# EAGLE board ebox (EAGLE 6.3)
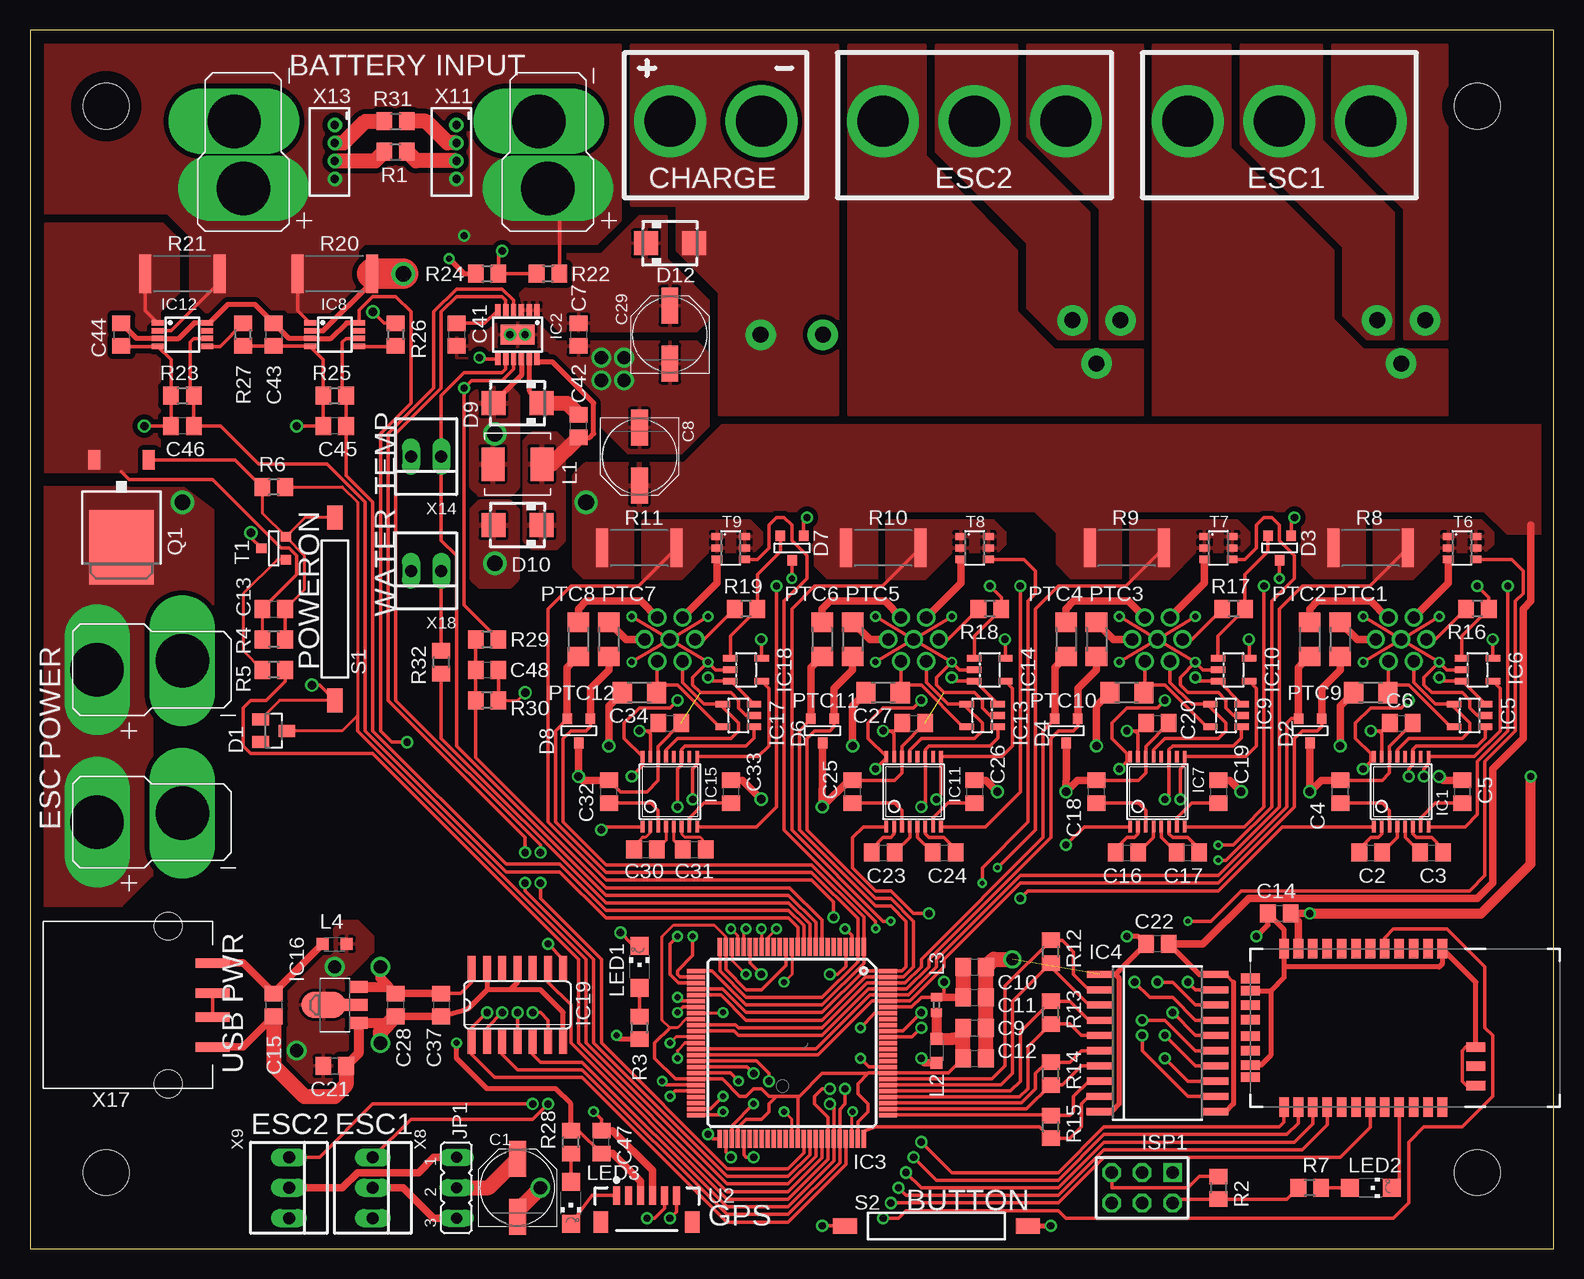
[diagram p2: board, top side]
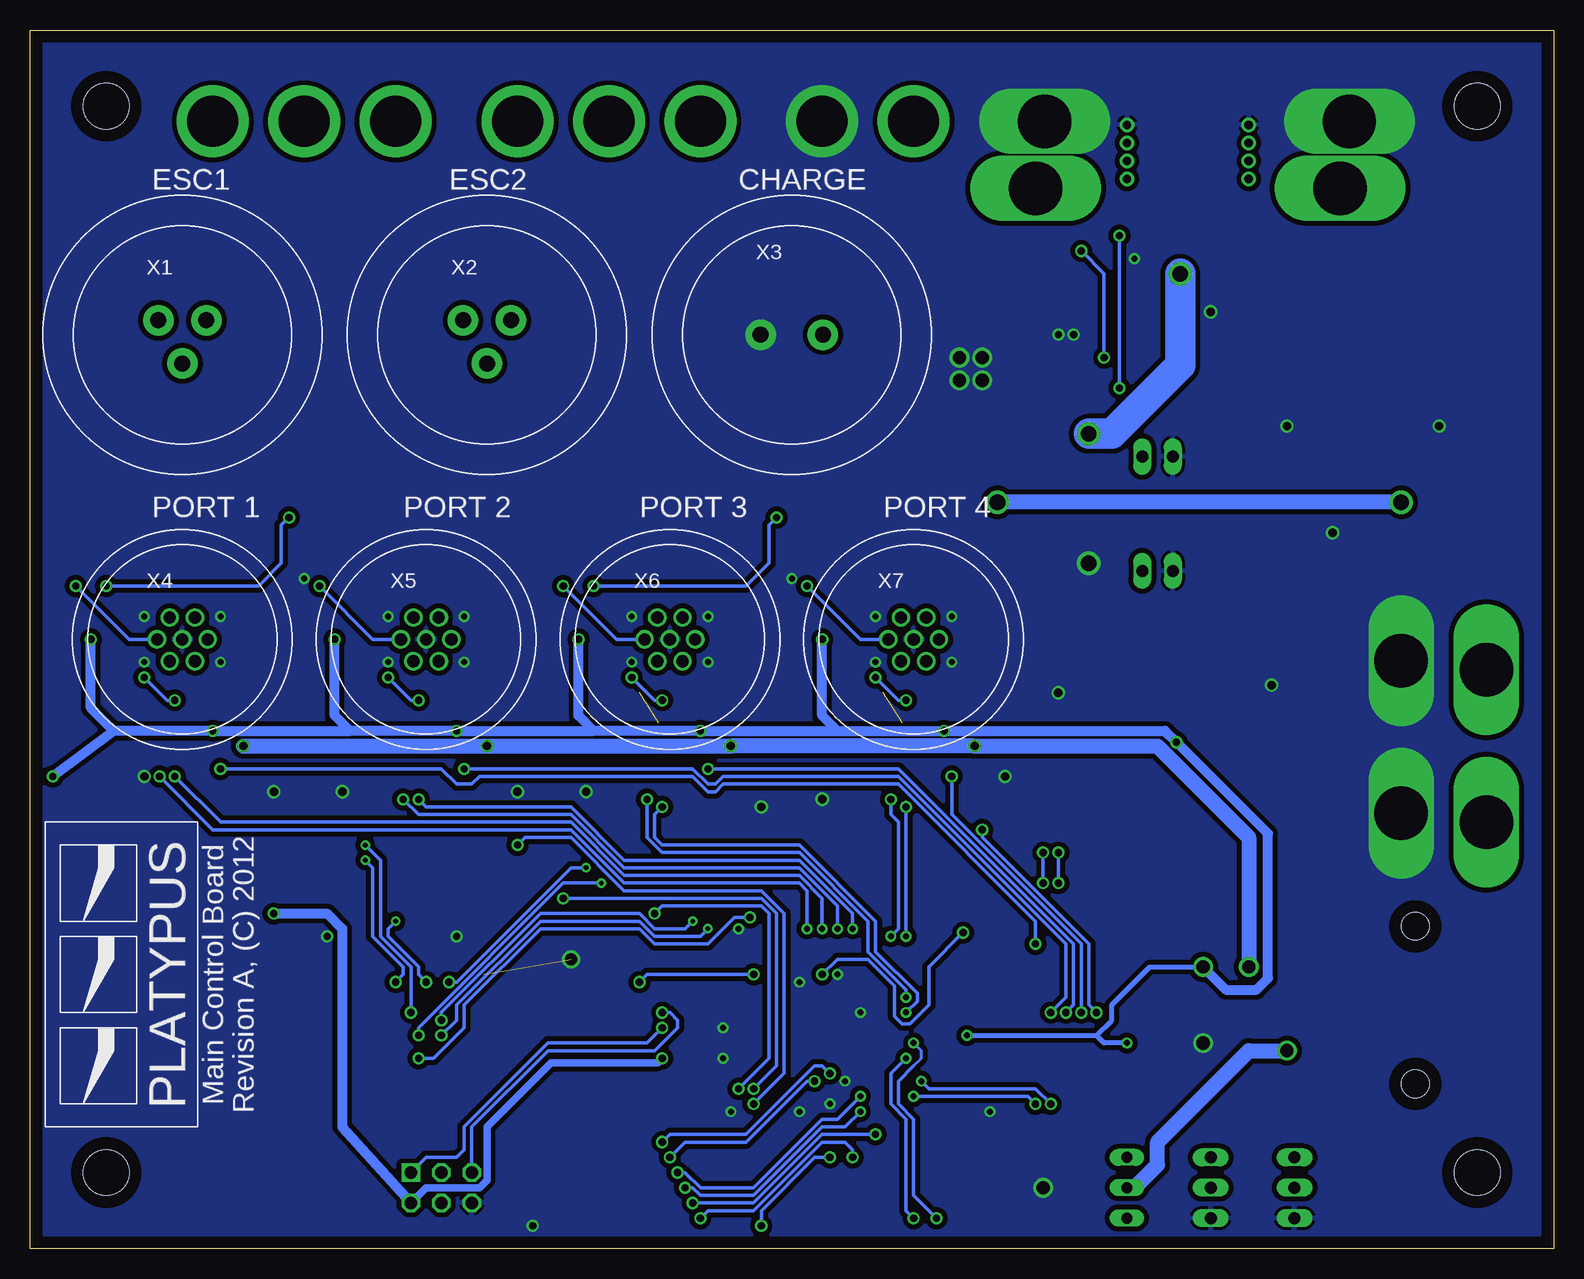
[diagram p3: board, bottom side, seen from below]

Size 127 x 101.6 mm. Coordinates in mm from the lower left corner, seen from the top.
Outline: 0,0 127,0 127,101.6 0,101.6 0,0
Copper layers (1*16): Top 0.035mm / dielectric 1.5mm / Bottom 0.035mm
Design rules "default *": minimum track width 10mil, minimum drill 15mil, track to track 5mil, track to pad 5mil, pad to pad 5mil, via to via 5mil, smd to smd 5mil, copper to edge 40mil, drill to drill 8mil, minimum pad ring 10mil, minimum via ring 8mil, stop-mask expansion 4mil, vias tented up to drill 0mil, thermal gap 10mil
Holes 3.81 mm at 120.65,95.25 120.65,6.35 6.35,6.35 6.35,95.25

## Footprints (pad centres in the part's own frame; a part is rotated, then mirrored left to right if it is on the bottom)
BULLET = drill 4.25 pad 6: P$1 0,0
PANASONIC_D = smd 3 x 1.4: + 2.4,0; - -2.4,0
C0805 = smd 1.3 x 1.5: 1 -0.95,0; 2 0.95,0
SOT23 = smd 1 x 1.4: 1 -0.95,-1.1; 2 0.95,-1.1; 3 0,1.1
SOT-23 = smd 0.787 x 0.889: 1 0.025,-1.016; 2 -0.94,1.016; 3 0.991,1.016
SMA = smd 2 x 2: A 2,0; C -2,0
TSSOP16 = smd 0.305 x 0.991: 1 -2.275,-2.918; 2 -1.625,-2.918; 3 -0.975,-2.918; 4 -0.325,-2.918; 5 0.325,-2.918; 6 0.975,-2.918; 7 1.625,-2.918; 8 2.275,-2.918; 9 2.275,2.918; 10 1.625,2.918; 11 0.975,2.918; 12 0.325,2.918; 13 -0.325,2.918; 14 -0.975,2.918; 15 -1.625,2.918; 16 -2.275,2.918
MSOP12-MSE = smd 0.45 x 1: 1 -1.625,-2.05; 2 -0.975,-2.05; 3 -0.325,-2.05; 4 0.325,-2.05; 5 0.975,-2.05; 6 1.625,-2.05; 7 1.625,2.05; 8 0.975,2.05; 9 0.325,2.05; 10 -0.325,2.05; 11 -0.975,2.05; 12 -1.625,2.05 | smd 2.845 x 1.651: 13 0,0
TQFP100 = smd 1.5 x 0.35: 1 -8,6; 2 -8,5.5; 3 -8,5; 4 -8,4.5; 5 -8,4; 6 -8,3.5; 7 -8,3; 8 -8,2.5; 9 -8,2; 10 -8,1.5; 11 -8,1; 12 -8,0.5; 13 -8,0; 14 -8,-0.5; 15 -8,-1; 16 -8,-1.5; 17 -8,-2; 18 -8,-2.5; 19 -8,-3; 20 -8,-3.5; 21 -8,-4; 22 -8,-4.5; 23 -8,-5; 24 -8,-5.5; 25 -8,-6; 51 8,-6; 52 8,-5.5; 53 8,-5; 54 8,-4.5; 55 8,-4; 56 8,-3.5; 57 8,-3; 58 8,-2.5; 59 8,-2; 60 8,-1.5; 61 8,-1; 62 8,-0.5; 63 8,0; 64 8,0.5; 65 8,1; 66 8,1.5; 67 8,2; 68 8,2.5; 69 8,3; 70 8,3.5; 71 8,4; 72 8,4.5; 73 8,5; 74 8,5.5; 75 8,6 | smd 0.35 x 1.5: 26 -6,-8; 27 -5.5,-8; 28 -5,-8; 29 -4.5,-8; 30 -4,-8; 31 -3.5,-8; 32 -3,-8; 33 -2.5,-8; 34 -2,-8; 35 -1.5,-8; 36 -1,-8; 37 -0.5,-8; 38 0,-8; 39 0.5,-8; 40 1,-8; 41 1.5,-8; 42 2,-8; 43 2.5,-8; 44 3,-8; 45 3.5,-8; 46 4,-8; 47 4.5,-8; 48 5,-8; 49 5.5,-8; 50 6,-8; 76 6,8; 77 5.5,8; 78 5,8; 79 4.5,8; 80 4,8; 81 3.5,8; 82 3,8; 83 2.5,8; 84 2,8; 85 1.5,8; 86 1,8; 87 0.5,8; 88 0,8; 89 -0.5,8; 90 -1,8; 91 -1.5,8; 92 -2,8; 93 -2.5,8; 94 -3,8; 95 -3.5,8; 96 -4,8; 97 -4.5,8; 98 -5,8; 99 -5.5,8; 100 -6,8
SOIC20R = smd 0.6 x 2.2: 1 -5.715,-4.775; 2 -4.445,-4.775; 3 -3.175,-4.775; 4 -1.905,-4.775; 5 -0.635,-4.775; 6 0.635,-4.775; 7 1.905,-4.775; 8 3.175,-4.775; 9 4.445,-4.8; 10 5.715,-4.8; 11 5.715,4.8; 12 4.445,4.8; 13 3.175,4.8; 14 1.905,4.8; 15 0.635,4.8; 16 -0.635,4.8; 17 -1.905,4.8; 18 -3.175,4.8; 19 -4.445,4.8; 20 -5.715,4.8
SOT23-DBV = smd 0.55 x 1.2: 1 -0.95,-1.3; 2 0,-1.3; 3 0.95,-1.3; 4 0.95,1.3; 5 -0.95,1.3
MSOP8 = smd 0.45 x 1: 1 -0.975,-2.05; 2 -0.325,-2.05; 3 0.325,-2.05; 4 0.975,-2.05; 5 0.975,2.05; 6 0.325,2.05; 7 -0.325,2.05; 8 -0.975,2.05
SOT89 = smd 1 x 1.5: 1 -1.499,-1.981; 3 1.499,-1.981 | smd 1 x 2: 2 0,-1.727 | smd 2.2 x 3.7: 2@1 0,0.94
SO14 = smd 0.66 x 2.032: 1 -3.81,-3.073; 2 -2.54,-3.073; 3 -1.27,-3.073; 4 0,-3.073; 5 1.27,-3.073; 6 2.54,-3.073; 7 3.81,-3.073; 8 3.81,3.073; 9 2.54,3.073; 10 1.27,3.073; 11 0,3.073; 12 -1.27,3.073; 13 -2.54,3.073; 14 -3.81,3.073
AVR-ISP-6 = drill 1.016 square: 1 -2.54,-1.27 | drill 1.016 octagon: 2 -2.54,1.27; 3 0,-1.27; 4 0,1.27; 5 2.54,-1.27; 6 2.54,1.27
JP2 = drill 0.914 long: 1 -2.54,0; 2 0,0; 3 2.54,0
IHLP-2020CZ-11 = smd 1.918 x 2.794: 1 -2.038,0; 2 2.038,0
L2012C = smd 1 x 1: 1 -1,0; 2 1,0
0402 = smd 0.7 x 0.9: 1 -0.65,0; 2 0.65,0
CHIPLED_1206 = smd 1.5 x 1.5: A 0,-1.75; C 0,1.75
R1206 = smd 1.6 x 1.803: 1 -1.422,0; 2 1.422,0
TO252 = smd 1 x 1.6: 1 -2.28,-4.8; 2 2.28,-4.8 | smd 5.4 x 6.2: 3 0,2.5
R0805 = smd 1.3 x 1.5: 1 -0.95,0; 2 0.95,0
R6332 = smd 1 x 3.2: 1 -3.1,0; 2 3.1,0
CT10-G1 = smd 2 x 1.3: 1 -7.62,0; 2 7.62,0
SOT23-6 = smd 0.6 x 0.9: 1 -0.95,-1.15; 2 0,-1.15; 3 0.95,-1.15; 4 0.95,1.15; 5 0,1.15; 6 -0.95,1.15
RN41 = smd 0.8 x 1.6: 1 -6.6,-6.6; 2 -5.4,-6.6; 3 -4.2,-6.6; 4 -3,-6.6; 5 -1.8,-6.6; 6 -0.6,-6.6; 7 0.6,-6.6; 8 1.8,-6.6; 9 3,-6.6; 10 4.2,-6.6; 11 5.4,-6.6; 12 6.6,-6.6; 13 6.6,6.6; 14 5.4,6.6; 15 4.2,6.6; 16 3,6.6; 17 1.8,6.6; 18 0.6,6.6; 19 -0.6,6.6; 20 -1.8,6.6; 21 -3,6.6; 22 -4.2,6.6; 23 -5.4,6.6; 24 -6.6,6.6 | smd 1.6 x 0.8: 25 -9.4,4.8; 26 -9.4,3.2; 27 -9.4,1.6; 28 9.4,3.1; 29 9.4,-3.1; 30 9.4,-4.122; 31 9.4,-1.9; 32 9.4,-0.7; 33 9.4,0.7; 34 9.4,1.9; 35 9.4,4.122
EM406 = smd 0.6 x 1.55: 1 0,0; 2 1,0; 3 2,0; 4 3,0; 5 4,0; 6 5,0 | smd 1.2 x 1.8: P$1 -1.3,-2.225; P$2 6.3,-2.225
7381-3PG-300 = drill 1.321 pad 2.54: 1 2,1.2; 2 -2,1.2; 3 0,-2.4
7381-2PG-300 = drill 1.321 pad 2.54: 1 2.6,0; 2 -2.6,0
17984-7PG-300 = drill 1.016: 1 -1.054,1.826; 2 -2.108,0; 3 -1.054,-1.826; 4 1.054,-1.826; 5 2.108,0; 6 1.054,1.826; 7 0,0
22-23-2031 = drill 1 long: 1 -2.54,0; 2 0,0; 3 2.54,0
DEANS_MALE = drill 4.445 pad 4.826 long: NEG -0.762,2.54; POS 0,-3.048
B4B-ZR = drill 0.7 pad 1.1: 1 -2.25,0; 2 -0.75,0; 3 0.75,0; 4 2.25,0
22-23-2021 = drill 1 long: 1 -1.27,0; 2 1.27,0
DEANS_FEMALE = drill 4.445 pad 4.826 long: NEG -0.762,2.54; POS 0,-4.572
1001-002-01100 = smd 0.8 x 2.82: 1 -3.5,0; 2 -1,0; 3 1,0; 4 3.5,0 | hole 2.3: -6.57,-3.71; 6.57,-3.71

## Placement (x,y rotation side)
B1  BULLET  [BULLET]  104.14,93.98 0 top
B2  BULLET  [BULLET]  111.76,93.98 0 top
B3  BULLET  [BULLET]  96.52,93.98 0 top
B4  BULLET  [BULLET]  78.74,93.98 0 top
B5  BULLET  [BULLET]  86.36,93.98 0 top
B6  BULLET  [BULLET]  71.12,93.98 0 top
B7  BULLET  [BULLET]  53.34,93.98 0 top
B8  BULLET  [BULLET]  60.96,93.98 0 top
C1  68uF  [PANASONIC_D]  40.64,5.08 90 top
C2  0.1uF  [C0805]  111.76,33.02 0 top
C3  0.1uF  [C0805]  116.84,33.02 0 top
C4  0.1uF  [C0805]  109.22,38.1 90 top
C5  0.1uF  [C0805]  119.38,38.1 270 top
C6  0.1uF  [C0805]  114.3,43.81 0 top
C7  1uF  [C0805]  45.72,76.2 270 top
C8  68uF  [PANASONIC_D]  50.8,66.04 270 top
C9  10uF  [C0805]  78.74,18.41 0 top
C10  10uF  [C0805]  78.74,23.5 0 top
C11  0.1uF  [C0805]  78.74,20.95 0 top
C12  0.1uF  [C0805]  78.74,15.88 0 top
C13  0.1uF  [C0805]  20.32,53.34 0 top
C14  0.1uF  [C0805]  104.14,27.94 180 top
C15  10uF  [C0805]  20.32,20.32 270 top
C16  0.1uF  [C0805]  91.44,33.02 0 top
C17  0.1uF  [C0805]  96.52,33.02 0 top
C18  0.1uF  [C0805]  88.9,38.1 90 top
C19  0.1uF  [C0805]  99.06,38.1 270 top
C20  0.1uF  [C0805]  93.98,43.81 0 top
C21  1uF  [C0805]  25.4,15.24 0 top
C22  10uF  [C0805]  93.98,25.4 180 top
C23  0.1uF  [C0805]  71.12,33.02 0 top
C24  0.1uF  [C0805]  76.2,33.02 0 top
C25  0.1uF  [C0805]  68.58,38.1 90 top
C26  0.1uF  [C0805]  78.74,38.1 270 top
C27  0.1uF  [C0805]  73.66,43.81 0 top
C28  1uF  [C0805]  30.48,20.32 270 top
C29  68uF  [PANASONIC_D]  53.34,76.2 90 top
C30  0.1uF  [C0805]  51.31,33.27 0 top
C31  0.1uF  [C0805]  55.37,33.27 0 top
C32  0.1uF  [C0805]  48.26,38.1 90 top
C33  0.1uF  [C0805]  58.42,38.1 270 top
C34  0.1uF  [C0805]  53.34,43.81 0 top
C37  0.1uF  [C0805]  34.29,20.32 270 top
C41  10uF  [C0805]  35.56,76.2 270 top
C42  1uF  [C0805]  45.72,68.58 90 top
C43  0.1uF  [C0805]  20.32,76.2 270 top
C44  0.1uF  [C0805]  7.62,76.2 270 top
C45  10pF  [C0805]  25.4,68.58 180 top
C46  10pF  [C0805]  12.7,68.58 180 top
C47  10uF  [C0805]  47.62,8.89 90 top
C48  10pF  [C0805]  38.1,48.26 0 top
D1  [SOT23]  20.32,43.18 270 top
D2  GSOT05C  [SOT-23]  106.68,43.18 0 top
D3  [SOT-23]  104.14,58.42 0 top
D4  GSOT05C  [SOT-23]  86.36,43.18 0 top
D6  GSOT05C  [SOT-23]  66.04,43.18 0 top
D7  [SOT-23]  63.5,58.42 0 top
D8  GSOT05C  [SOT-23]  45.72,43.18 0 top
D9  MBRA340T3  [SMA]  40.64,70.48 180 top
D10  MBRA340T3  [SMA]  40.64,60.33 180 top
D12  MBRA340T3  [SMA]  53.34,83.82 0 top
IC1  MAX3221CUE  [TSSOP16]  114.3,38.1 0 top
IC2  LT3652  [MSOP12-MSE]  40.64,76.2 180 top
IC3  XMEGA128A1  [TQFP100]  63.5,17.14 270 top
IC4  LT1161  [SOIC20R]  93.98,17.14 270 top
IC5  SN74LVC1G125  [SOT23-DBV]  120.02,44.45 90 top
IC6  SN74LVC1G125  [SOT23-DBV]  120.65,48.26 270 top
IC7  MAX3221CUE  [TSSOP16]  93.98,38.1 0 top
IC8  INA170  [MSOP8]  25.4,76.2 270 top
IC9  SN74LVC1G125  [SOT23-DBV]  99.69,44.45 90 top
IC10  SN74LVC1G125  [SOT23-DBV]  100.33,48.26 270 top
IC11  MAX3221CUE  [TSSOP16]  73.66,38.1 0 top
IC12  INA170  [MSOP8]  12.7,76.2 270 top
IC13  SN74LVC1G125  [SOT23-DBV]  79.38,44.45 90 top
IC14  SN74LVC1G125  [SOT23-DBV]  80.01,48.26 270 top
IC15  MAX3221CUE  [TSSOP16]  53.34,38.1 0 top
IC16  MCP170333MB  [SOT89]  25.4,20.32 90 top
IC17  SN74LVC1G125  [SOT23-DBV]  59.05,44.45 90 top
IC18  SN74LVC1G125  [SOT23-DBV]  59.69,48.26 270 top
IC19  74ALS04D  [SO14]  40.64,20.32 0 top
ISP1  AVR-PDIVERT  [AVR-ISP-6]  92.71,5.08 180 top
JP1  [JP2]  35.56,5.08 270 top
L1  5.6uH  [IHLP-2020CZ-11]  40.64,65.41 180 top
L2  10uH  [L2012C]  75.56,16.51 270 top
L3  FERRITE  [0402]  75.56,20.32 270 top
L4  10uH  [L2012C]  25.4,25.4 0 top
LED1  YEL  [CHIPLED_1206]  50.8,23.5 0 top
LED2  RED  [CHIPLED_1206]  111.76,5.08 270 top
LED3  GRN  [CHIPLED_1206]  45.09,3.81 180 top
PTC1  50mA  [R1206]  109.22,50.8 90 top
PTC2  50mA  [R1206]  106.68,50.8 90 top
PTC3  50mA  [R1206]  88.9,50.8 90 top
PTC4  50mA  [R1206]  86.36,50.8 90 top
PTC5  50mA  [R1206]  68.58,50.8 90 top
PTC6  50mA  [R1206]  66.04,50.8 90 top
PTC7  50mA  [R1206]  48.26,50.8 90 top
PTC8  50mA  [R1206]  45.72,50.8 90 top
PTC9  1A  [R1206]  111.76,46.35 0 top
PTC10  1A  [R1206]  91.44,46.35 0 top
PTC11  1A  [R1206]  71.12,46.35 0 top
PTC12  1A  [R1206]  50.8,46.35 0 top
Q1  FDD4141TO252  [TO252]  7.62,60.96 180 top
R1  1k  [R0805]  30.48,91.44 0 top
R2  10k  [R0805]  99.06,5.08 270 top
R3  330  [R0805]  50.8,18.41 270 top
R4  1k  [R0805]  20.32,50.8 180 top
R5  10k  [R0805]  20.32,48.26 180 top
R6  100k  [R0805]  20.32,63.5 180 top
R7  330  [R0805]  106.68,5.08 180 top
R8  0.010  [R6332]  111.76,58.42 180 top
R9  0.010  [R6332]  91.44,58.42 180 top
R10  0.010  [R6332]  71.12,58.42 180 top
R11  0.010  [R6332]  50.8,58.42 180 top
R12  2K  [R0805]  85.09,24.77 90 top
R13  2K  [R0805]  85.09,19.68 90 top
R14  2K  [R0805]  85.09,14.61 90 top
R15  2K  [R0805]  85.09,10.16 90 top
R16  100k  [R0805]  120.65,53.34 180 top
R17  100k  [R0805]  100.33,53.34 180 top
R18  100k  [R0805]  80.01,53.34 180 top
R19  100k  [R0805]  59.69,53.34 180 top
R20  0.050  [R6332]  25.4,81.28 180 top
R21  0.010  [R6332]  12.7,81.28 180 top
R22  626k  [R0805]  43.18,81.28 0 top
R23  4.99k  [R0805]  12.7,71.12 0 top
R24  412k  [R0805]  38.1,81.28 0 top
R25  1k  [R0805]  25.4,71.12 0 top
R26  2k  [R0805]  30.48,76.2 270 top
R27  10k  [R0805]  17.78,76.2 90 top
R28  330  [R0805]  45.09,8.89 90 top
R29  10k  [R0805]  38.1,50.8 0 top
R30  2k  [R0805]  38.1,45.72 180 top
R31  1k  [R0805]  30.48,93.98 0 top
R32  1K  [R0805]  34.29,48.9 90 top
S1  REED-SWITCH-CT10-1530-G1  [CT10-G1]  25.4,53.34 270 top
S2  REED-SWITCH-CT10-1530-G1  [CT10-G1]  75.56,1.91 0 top
T1  [SOT-23]  20.32,58.42 270 top
T6  [SOT23-6]  119.38,58.42 270 top
T7  [SOT23-6]  99.06,58.42 270 top
T8  [SOT23-6]  78.74,58.42 270 top
T9  [SOT23-6]  58.42,58.42 270 top
U1  BLUETOOTH-RN42  [RN41]  111.12,18.41 180 top
U2  D2523T_  [EM406]  48.9,4.45 0 top
U$1  PLATYPUS_LOGO  [PLATYPUS_LOGO_SMALL]  119.38,22.86 90 bottom
X1  7381-3PG-300  [7381-3PG-300]  114.3,76.2 0 bottom
X2  7381-3PG-300  [7381-3PG-300]  88.9,76.2 0 bottom
X3  7381-2PG-300  [7381-2PG-300]  63.5,76.2 0 bottom
X4  17984-7PG-300  [17984-7PG-300]  114.3,50.8 0 bottom
X5  17984-7PG-300  [17984-7PG-300]  93.98,50.8 0 bottom
X6  17984-7PG-300  [17984-7PG-300]  73.66,50.8 0 bottom
X7  17984-7PG-300  [17984-7PG-300]  53.34,50.8 0 bottom
X8  22-23-2031  [22-23-2031]  28.57,5.08 270 top
X9  22-23-2031  [22-23-2031]  21.59,5.08 270 top
X10  DEANS-MALE  [DEANS_MALE]  43.18,91.44 0 top
X11  B4B-ZR  [B4B-ZR]  35.56,91.44 270 top
X12  DEANS-MALE  [DEANS_MALE]  17.78,91.44 0 top
X13  B4B-ZR  [B4B-ZR]  25.4,91.44 270 top
X14  22-23-2021  [22-23-2021]  33.02,66.04 180 top
X15  DEANS-FEMALE  [DEANS_FEMALE]  10.16,48.26 270 top
X16  DEANS-FEMALE  [DEANS_FEMALE]  10.16,35.56 270 top
X17  USB_A  [1001-002-01100]  15.24,20.32 270 top
X18  22-23-2021  [22-23-2021]  33.02,56.52 180 top

## Tracks (layer width: path | path; a pad name or v marks a point on that pad's centre or on a via)
3ROU  (via drill 0.38, 0.6)
  Top 0.305: 120.97,57.47 T6.4 123.5,57.47 124.46,56.52 124.46,54.61 123.83,53.98 123.83,43.18 121.28,40.64 121.28,31.11 120.02,29.84 100.97,29.84 98.42,27.3 v96.52,27.3 | IC4.18 97.16,20.32 95.25,22.23 v93.98,22.23
  Bottom 0.305: v96.52,27.3 97.16,26.67 97.16,26.04 94.61,23.5 94.61,22.86 v93.98,22.23
!CHRG  (via drill 0.6)
  Top 0.305: IC2.4 40.31,79.06 39.37,80.01 35.56,80.01 33.66,78.11 33.66,71.75 29.84,67.94 29.84,45.72 41.27,34.29 v41.27,33.02 | IC3.66 65,7.85 63.18,6.03 58.1,6.03 46.99,17.14 46.99,24.13 41.27,29.84 v41.27,30.48
  Bottom 0.305: v41.27,30.48 v41.27,33.02
!CHRG_FAULT  (via drill 0.6)
  Top 0.305: IC2.5 39.66,79.08 39.37,79.38 35.56,79.38 34.29,78.11 34.29,71.75 30.48,67.94 30.48,45.72 42.55,33.66 v42.55,33.02 | IC3.65 64.5,7.99 63.18,6.67 58.1,6.67 47.62,17.14 47.62,24.13 42.55,29.21 v42.55,30.48
  Bottom 0.305: v42.55,30.48 v42.55,33.02
!EN232_1  (via drill 0.6)
  Top 0.305: IC19.9 43.18,22.23 45.09,20.32 45.09,17.14 58.1,4.13 63.18,4.13 66.5,7.45 IC3.69 66.5,10.97 65.41,12.06 65.41,12.7 66.04,13.34 v66.67,13.34 | IC1.1 104.4,35.18 99.06,29.84 83.19,29.84 v82.55,29.21
  Bottom 0.305: v66.67,13.34 64.77,15.24 64.77,27.94 66.04,29.21 v82.55,29.21
!EN232_2  (via drill 0.6)
  Top 0.305: IC19.5 41.91,16.19 42.55,15.56 46.04,15.56 58.1,3.49 63.18,3.49 67,7.31 IC3.70 67,11.74 v66.67,12.06 | IC7.1 87.89,35.18 v86.36,33.66
  Bottom 0.305: v86.36,33.66 85.72,34.29 81.92,34.29 77.47,29.84 66.04,29.84 64.14,27.94 64.14,14.61 v66.67,12.06
!EN232_3  (via drill 0.6)
  Top 0.305: IC19.3 39.37,16.19 40.64,14.92 46.04,14.92 58.1,2.86 63.18,2.86 67.5,7.17 IC3.71 67.5,11.62 67.94,12.06 v67.94,13.34 | IC11.1 69.47,35.18 68.58,34.29 68.58,31.75 70.48,29.84 71.75,29.84 73.66,27.94 v74.93,27.94
  Bottom 0.305: v67.94,13.34 65.41,15.88 65.41,27.94 66.04,28.57 74.3,28.57 v74.93,27.94
!EN232_4  (via drill 0.6)
  Top 0.305: IC3.72 68,7.04 63.18,2.22 58.1,2.22 46.04,14.29 38.73,14.29 36.83,16.19 IC19.1 36.83,18.41 v38.1,19.68 | IC15.1 47.88,35.18 v47.62,34.92
  Bottom 0.305: v38.1,19.68 38.73,20.32 38.73,25.4 47.62,34.29 v47.62,34.92
+3V3  (via drill 0.5, 0.6, 1.1)
  Top 0.305: R7.2 104.78,4.13 R2.2 95.57,4.13 ISP1.2 | IC19.14 36.83,22.23 35.88,21.27 C37.1 | IC6.5 121.92,49.24 v121.92,50.8 | IC10.5 101.63,50.77 v101.6,50.8 | C27.1 72.08,43.18 71.75,43.18 | 71.75,43.18 v71.12,43.18 | IC14.5 81.31,50.77 v81.28,50.8 | IC18.5 60.96,49.24 v60.96,50.8 | C34.1 51.76,43.18 51.44,43.18 | 51.44,43.18 v50.8,43.18 | R28.2 45.73,9.84 C47.1 | IC8.8 27.45,78.25 28.57,79.38 30.48,79.38 31.75,78.11 31.75,70.48 29.21,67.94 29.21,43.18 30.16,42.23 v31.43,42.23 | IC1.15 112.67,42.9 112.39,43.18 | v111.76,43.18 112.39,43.18 | C6.1 112.72,43.18 112.39,43.18 | C20.1 92.39,43.18 92.08,43.18 | 92.08,43.18 v91.44,43.18 | IC7.15 92.36,42.9 92.08,43.18 | IC11.15 72.03,42.9 71.75,43.18 | IC15.15 51.72,42.9 51.44,43.18
  Top 0.406: C44.1 8.89,75.88 IC12.3 12.38,75.88 13.68,77.17 IC12.8 14.95,77.17 16.51,78.74 18.73,78.74 C43.1 21.59,75.88 IC8.3 25.07,75.88 26.38,77.17 IC8.8 | R28.2 45.09,12.06 43.81,13.34 38.1,13.34 35.56,15.88 v35.56,17.14 | R3.2 49.21,17.46 v48.9,17.78
  Top 0.61: U1.11 105.72,27.3 C14.1 v106.68,27.94 | 29.93,21.82 C28.1 C37.1 | L2.2 74.56,15.51 v74.3,15.88 | U2.3 50.9,5.62 48.58,7.94 C47.1
  Top 0.813: IC16.3 29.93,21.82 29.21,22.54 v29.21,23.5 | v106.68,27.94 120.97,27.94 125.09,32.07 v125.09,39.37
  Bottom 0.406: 29.06,23.5 v29.21,23.5 33.66,23.5 36.83,20.32 36.83,19.05 38.1,17.78 | v48.9,17.78 38.1,17.78 | v35.56,17.14 37.47,17.14 38.1,17.78
  Bottom 0.61: ISP1.2 93.98,5.08 89.53,5.08 88.9,5.71 88.9,10.16 83.55,15.51 74.66,15.51 v74.3,15.88
  Bottom 0.813: v106.68,27.94 102.23,27.94 100.97,26.67 100.97,10.16 ISP1.2 | v29.21,23.5 27.3,21.59 24.77,21.59 23.81,22.54 23.81,34.61 v31.43,42.23 32.38,43.18 v50.8,43.18 59.69,43.18 | v121.92,50.8 121.92,45.09 120.02,43.18 | 80.01,43.18 v71.12,43.18 59.69,43.18 | 100.33,43.18 v91.44,43.18 80.01,43.18 | 120.02,43.18 v111.76,43.18 100.33,43.18 | 100.33,43.18 101.6,44.45 v101.6,50.8 | 80.01,43.18 81.28,44.45 v81.28,50.8 | 59.69,43.18 60.96,44.45 v60.96,50.8 | 120.02,43.18 v125.09,39.37
+5V  (via drill 0.7, 1.1)
  Top 0.61: PTC12.1 48.26,45.24 v48.26,41.91 | PTC11.1 68.58,45.24 v68.58,41.91 | PTC10.1 88.9,45.24 v88.9,41.91 | PTC9.1 109.22,45.24 v109.22,41.91
  Top 1.27: JP1.2 38.24,5.08 C1.+
  Bottom 1.27: JP1.2 34.92,5.08 33.02,6.99 33.02,8.89 25.4,16.51 v22.23,16.51 | v109.22,41.91 v88.9,41.91 v68.58,41.91 v48.26,41.91 33.02,41.91 25.4,34.29 v25.4,23.5
  pour Top (isolate 0.406): 25.4,26.67 25.4,25.4 20.32,20.95 20.32,15.88 23.5,12.7 24.77,12.7 26.04,13.97 26.04,15.88 26.67,16.51 26.67,22.86 28.57,24.77 28.57,26.04 27.3,27.3 26.04,27.3
+12V  (via drill 1.3)
  Top 0.305: IC4.20 99.69,22.86 100.33,22.23
  Top 0.406: C22.1 97.47,22.86 IC4.20 | 97.79,11.43 IC4.11 99.69,11.43 100.33,12.06 100.33,22.23
  Top 0.61: 125.09,60.33 125.09,53.98 124.46,53.34 124.46,42.55 121.92,40.01 121.92,30.48 120.65,29.21 101.6,29.21 97.79,25.4 C22.1
  Bottom 1.27: v12.7,62.23 v46.35,62.23
  pour Top (isolate 0.406, no thermals): 1.27,63.5 12.7,63.5 15.24,61.59 15.24,53.34 10.16,48.26 10.16,31.11 7.62,28.57 1.27,28.57
  pour Top (isolate 0.406): 46.35,65.41 54.61,65.41 57.78,68.58 127,68.58 127,59.69 123.19,59.69 121.28,61.59 111.12,61.59 111.12,55.88 107.31,55.88 106.05,57.15 106.05,60.33 104.78,61.59 90.81,61.59 90.81,55.88 87,55.88 85.72,57.15 85.72,59.69 83.82,61.59 70.48,61.59 70.48,55.88 66.67,55.88 65.41,57.15 65.41,60.33 64.14,61.59 50.16,61.59 50.16,55.88 46.35,55.88 45.4,56.83 45.4,64.45
  pour Top (isolate 0.406, no thermals): 46.35,60.33 46.35,55.88 49.53,55.88 49.53,60.96 46.35,60.96
  pour Top (isolate 0.406, no thermals): 66.67,60.96 66.67,56.52 67.31,55.88 69.22,55.88 69.22,60.96
  pour Top (isolate 0.406, no thermals): 86.36,60.96 86.36,57.15 87.63,55.88 89.53,55.88 89.53,60.96
  pour Top (isolate 0.406, no thermals): 107.31,61.59 107.31,56.52 107.95,55.88 109.86,55.88 109.86,61.59
AVR_AVCC  (via drill 0.6)
  Top 0.305: IC3.94 73.47,20.14 74.3,20.97 L3.1 | IC3.4 68,23.55 67.31,22.86 v66.67,22.86 | v76.2,22.23 76.2,20.95
  Top 0.61: C11.1 76.2,20.95 75.58,20.95 L3.1
  Top 1.27: C10.1 C11.1
  Bottom 0.305: v66.67,22.86 75.56,22.86 v76.2,22.23
AVR_VCC
  Top 0.254: IC3.34 54.7,19.14 53.98,18.41 53.34,18.41 52.7,19.05 52.7,26.04 53.66,26.99 57.02,26.99 58,26.01 IC3.24
  Top 0.305: C12.1 76.56,14.64 IC3.83 69.89,14.64 69.85,14.61 | 69.85,14.61 69,13.76 69,12.91 69.85,12.06 69.85,11.43 69,10.58 IC3.74 | 69.85,14.61 66.04,14.61 64.14,12.7 | IC3.64 64,12.56 64.14,12.7 | IC3.54 59,10.11 59.69,10.79 60.96,10.79 61.59,11.43 61.59,12.06 62.23,12.7 | 62.23,12.7 61.59,12.7 60.96,13.34 60.33,13.34 59.69,12.7 59.16,12.7 57.72,14.14 IC3.44 53.8,14.14 52.07,15.88 52.07,17.14 53.34,18.41 | 62.23,12.7 64.14,12.7 | IC3.24 58,23.28 59.69,21.59 60.96,21.59 63,23.63 IC3.14
  Top 0.813: L3.2 L2.1
  Top 1.016: L2.1 76.89,17.51 arc90 C9.1
  Top 1.27: C12.1 C9.1
BATT1
  Top 1.27: X11.2 34.81,92.19 33.02,93.98 R31.2
BATT2
  Top 1.27: X11.3 32.18,90.69 R1.2
BATT+  (via drill 0.6)
  Top 0.305: IC12.2 11.76,76.53 15.8,80.57 R21.1 | R20.2 22.3,78.22 IC8.1 | R22.2 44.13,87.44 X10.POS | R29.2 36.2,53.66 v36.2,71.75 36.83,72.39 39.37,72.39 40.31,73.33 IC2.9
  Bottom 0.305: v36.2,84.45 v36.2,71.75
  pour Top (isolate 0.406, no thermals): 1.27,100.33 1.27,86.36 11.43,86.36 13.34,84.45 13.34,79.38 14.61,78.11 25.4,78.11 27.3,80.01 27.3,83.19 27.94,83.82 47.31,83.82 49.21,85.72 49.21,100.33
BATT_CURR_IN
  Top 0.305: IC8.6 26.34,75.88 26.04,75.56 26.04,71.44 R25.2 C45.1 26.35,64.45 28.57,62.23 28.57,43.18 39.69,32.07 44.13,32.07 48.01,28.19 63.25,28.19 64.5,26.94 IC3.11
BATT_CURR_OUT
  Top 0.305: IC12.6 13.64,75.88 13.34,75.56 13.34,71.44 R23.2 C46.1 15.88,68.58 19.05,65.41 24.77,65.41 27.94,62.23 27.94,43.18 39.69,31.43 44.13,31.43 48.01,27.56 63.25,27.56 64,26.8 IC3.12
BATT_TEMP
  Top 0.305: IC2.8 39.66,73.32 39.37,73.03 36.2,73.03 34.29,71.12 X14.1 34.29,59.05 35.56,57.78 35.56,41.91 48.01,29.46 63.25,29.46 65.5,27.21 IC3.9
BATT_VSENSE
  Top 0.305: R29.1 C48.1 R30.2 37.15,40.95 48.01,30.1 63.31,30.1 66,27.41 IC3.8
BT_CTS  (via drill 0.5, 0.6)
  Top 0.305: U1.16 108.12,10.34 106.05,8.26 89.53,8.26 85.72,4.45 73.03,4.45 v72.39,5.08 | IC3.50 57.5,11.14 v57.78,11.43
  Bottom 0.305: v57.78,11.43 59.05,10.16 60.96,10.16 66.67,4.45 71.12,4.45 71.75,5.08 v72.39,5.08
BT_RESET  (via drill 0.6)
  Top 0.305: U1.5 112.92,25.93 113.67,26.67 118.11,26.67 121.28,23.5 121.28,18.41 121.92,17.78 121.92,12.7 119.38,10.16 116.2,10.16 114.94,8.89 114.94,3.81 113.67,2.54 86.36,2.54 85.72,3.17 73.03,3.17 72.39,2.54 v71.12,2.54 | IC3.52 58,8.04 v58.42,7.62
  Bottom 0.305: v58.42,7.62 58.42,8.26 59.05,8.89 60.96,8.89 66.67,3.17 70.48,3.17 v71.12,2.54
BT_RTS  (via drill 0.5, 0.6)
  Top 0.305: U1.15 106.92,10.4 105.41,8.89 89.53,8.89 85.72,5.08 74.3,5.08 v73.03,6.35 | IC3.49 56.73,11.64 v57.78,12.7
  Bottom 0.305: v73.03,6.35 72.39,6.35 71.12,5.08 66.67,5.08 60.96,10.79 59.69,10.79 v57.78,12.7
BT_RXD  (via drill 0.6)
  Top 0.305: U1.14 105.72,10.47 104.78,9.53 89.53,9.53 85.72,5.71 75.56,5.71 v73.66,7.62 | IC3.41 60.55,15.64 61.59,14.61 v61.59,13.97
  Bottom 0.305: v73.66,7.62 72.39,8.89 67.31,8.89 62.23,13.97 v61.59,13.97
BT_STATUS  (via drill 0.6)
  Top 0.305: v71.75,3.81 85.72,3.81 89.53,7.62 109.22,7.62 111.72,10.12 U1.19 | IC3.51 56.9,9.14 v56.52,9.53
  Bottom 0.305: v71.75,3.81 66.67,3.81 60.96,9.53 v56.52,9.53
BT_TXD  (via drill 0.6)
  Top 0.305: U1.13 104.53,10.54 104.14,10.16 89.53,10.16 85.72,6.35 76.83,6.35 v74.3,8.89 | IC3.42 59.78,15.14 v60.33,14.61
  Bottom 0.305: v60.33,14.61 60.96,15.24 61.59,15.24 67.31,9.53 73.66,9.53 v74.3,8.89
CHARGE
  pour Top (isolate 0.406, no thermals): 50.16,100.33 67.31,100.33 67.31,69.53 57.47,69.53 57.47,79.69 53.98,83.19 53.98,87 50.16,87
CHRG+  (via drill 1.3)
  Top 0.406: IC2.10 40.97,72.81 D9.A | IC8.2 24.45,76.53 28.5,80.57 R20.1
  Top 2.54: R20.1 v31.11,81.28
  Bottom 2.54: v31.11,81.28 31.11,73.66 36.83,67.94 v38.73,67.94
  pour Top: 36.83,71.12 37.47,71.75 40.01,71.75 40.64,71.12 40.64,63.5 40.01,62.87 37.47,62.87 36.83,63.5
EN232_1  (via drill 0.6)
  Top 0.305: IC6.3 119.35,47.37 | IC6.3 119.41,47.31 IC5.3 | IC1.16 111.76,41.27 | v114.94,45.72 114.3,45.09 111.76,45.09 110.49,43.81 110.49,42.55 111.76,41.27 | v117.47,47.62 117.8,47.31 IC6.3 | 111.76,41.27 111.76,40.64 v111.12,40.01 | IC19.8 44.45,24.13 v43.18,25.4
  Bottom 0.305: v114.94,45.72 115.57,45.72 v117.47,47.62 | v111.12,40.01 92.71,40.01 91.44,38.73 90.17,38.73 89.53,39.37 71.75,39.37 70.48,38.1 69.85,38.1 69.22,38.73 54.61,38.73 43.18,27.3 v43.18,25.4
EN232_2  (via drill 0.6)
  Top 0.305: IC9.3 99.08,47.31 IC10.3 97.47,47.31 v97.16,47.62 | IC7.16 91.44,41.27 | v94.61,45.72 93.98,45.09 91.44,45.09 90.17,43.81 90.17,42.55 91.44,41.27 | 91.44,41.27 91.44,40.64 v90.81,40.01 | IC19.6 43.18,19.05 42.55,19.68 v41.91,19.68
  Bottom 0.305: v97.16,47.62 95.25,45.72 v94.61,45.72 | v90.81,40.01 71.75,40.01 70.48,38.73 69.85,38.73 69.22,39.37 54.61,39.37 40.64,25.4 40.64,20.95 v41.91,19.68
EN232_3  (via drill 0.6)
  Top 0.305: IC13.3 78.77,47.31 IC14.3 77.15,47.31 v76.83,47.62 | v74.3,45.72 73.66,45.09 71.12,45.09 69.85,43.81 69.85,42.55 69.86,42.55 IC11.16 71.38,40.9 v70.48,40.01 | v40.64,19.68 IC19.4
  Bottom 0.305: v74.3,45.72 74.93,45.72 v76.83,47.62 | v40.64,19.68 40.01,20.32 40.01,25.4 54.61,40.01 v70.48,40.01
EN232_4  (via drill 0.6)
  Top 0.305: IC17.3 58.45,47.31 IC18.3 56.83,47.31 v56.52,47.62 | v53.98,45.72 53.34,45.09 50.8,45.09 49.53,43.81 49.53,42.55 51.06,41.02 IC15.16 51.06,40.27 v50.16,39.37 | IC19.2 38.1,18.41 v39.37,19.68
  Bottom 0.305: v53.98,45.72 54.61,45.72 v56.52,47.62 | v50.16,39.37 50.16,36.2 39.37,25.4 v39.37,19.68
FAULT1
  Top 0.305: IC3.82 80.19,14.14 81.28,15.24 81.28,21.91 R12.2 86.05,25.71 87,24.77 87,22.86 88.27,21.59 IC4.2
FAULT2
  Top 0.305: IC3.80 81.72,13.14 82.55,13.97 82.55,18.09 R13.2 86.68,20.64 88.27,19.05 IC4.4
FAULT3
  Top 0.305: IC3.78 82.63,12.14 83.82,13.34 83.82,14.61 84.77,15.55 R14.2 86.67,15.55 87.63,16.51 IC4.6
FAULT4
  Top 0.305: IC3.76 84.42,11.14 R15.2 86.67,11.11 87,11.43 87,12.7 88.27,13.97 IC4.8
GND  (via drill 0.5, 0.6, 0.7, 1, 1.1, 1.3)  (3 unrouted)
  Top 0.254: X5.7 v97.16,48.9 | X5.7 v97.16,52.7 | X5.7 v90.81,52.7 | X5.7 v90.81,48.9 | X4.7 v117.47,52.7 | X4.7 v117.47,48.9 | X4.7 v111.12,48.9 | X4.7 v111.12,52.7 | X6.7 v76.83,52.7 | X6.7 v76.83,48.9 | X6.7 v70.48,48.9 | X6.7 v70.48,52.7 | X7.7 v56.52,52.7 | X7.7 v56.52,48.9 | X7.7 v50.16,48.9 | X7.7 v50.16,52.7 | S1.2 20.81,45.72 D1.1 | IC3.13 63.5,22.86 v62.87,22.23 | IC3.23 58.5,24.05 v59.69,22.86 | IC3.33 57.74,19.64 v57.78,19.68 | IC3.63 63.5,10.79 v62.87,11.43 | IC3.73 68.5,11.35 v68.58,11.43 | R30.1 40.64,45.72 v41.27,46.35
  Top 0.305: C44.2 7.64,75.22 IC12.4 11.75,74.12 R23.1 C46.2 v9.53,68.58 | R27.1 C43.2 23.32,75.25 IC8.4 24.45,74.12 R25.1 C45.2 v22.23,68.58 | C18.2 92.39,39.05 93,39.66 IC7.14 93,41.89 C20.2 | C4.2 112.71,39.05 113.33,39.66 IC1.14 113.33,41.89 C6.2 | C25.2 72.07,39.05 72.69,39.66 IC11.14 72.69,41.89 C27.2 | C48.2 R30.1 | IC18.2 57.15,48.26 v56.52,48.9 55.24,47.62 55.24,46.99 55.88,46.35 58.42,46.35 59.05,45.72 59.05,45.09 59.69,44.45 IC17.2 | IC14.2 77.47,48.26 v76.83,48.9 75.56,47.62 75.56,46.99 76.2,46.35 78.74,46.35 79.38,45.72 79.38,45.09 80.01,44.45 IC13.2 | IC10.2 97.79,48.26 v97.16,48.9 95.89,47.62 95.89,46.99 96.52,46.35 99.06,46.35 99.69,45.72 99.69,45.09 100.33,44.45 IC9.2 | IC6.2 118.11,48.26 v117.47,48.9 116.2,47.62 116.2,46.99 116.84,46.35 119.38,46.35 120.02,45.72 120.02,45.09 120.65,44.45 IC5.2 | R26.1 29.53,77.15 v28.57,78.11 | v18.41,59.69 18.41,59.28 T1.1 | v23.5,46.99 24.13,46.99 S1.2 | D7.1 63.52,55.91 v63.5,55.88 | D3.1 104.17,55.91 v104.14,55.88 | IC3.93 70.44,19.64 v69.22,18.41 | IC3.84 69.94,15.14 v69.22,15.88 | v46.99,11.43 47.62,10.79 C47.2 | IC3.3 68.5,26.11 v67.94,26.67 | U1.27 119.69,16.82 119.38,16.51 119.38,13.97 119.73,13.62 U1.25 | IC3.43 58.38,14.64 v59.05,13.97 | v60.33,12.06 58.5,10.24 IC3.53 | C34.2 52.37,41.89 IC15.14 52.37,39.03 51.44,38.1 49.21,38.1 C32.2
  Top 0.406: S2.2 v85.09,1.91 | IC4.1 90.49,22.86 | 90.49,22.86 C22.2 92.39,26.04 v91.44,26.04 | v102.23,26.04 103.19,26.99 C14.2 104.53,26.61 U1.12 104.53,23.5 | IC4.10 90.17,11.43 90.81,12.06 90.81,22.55 90.49,22.86 | 104.53,23.5 104.53,22.61 103.43,21.52 | U1.29 103.43,21.52 | U1.27 120.53,22.21 U1.1 117.72,23.75 117.47,23.5 104.53,23.5 | C37.2 36.52,20 38.1,21.59 | IC19.13 38.1,21.59 | IC19.11 40.64,22.23 40.01,21.59 | 40.01,21.59 38.1,21.59 | IC19.7 44.45,19.68 42.55,21.59 40.01,21.59 | v34.92,82.55 36.2,81.28 R24.1 | U1.28 102.63,15.31 103.43,16.12 103.43,21.52
  Top 0.61: X17.4 17.77,16.82 C15.2 | 29.93,18.82 C28.2 C37.2 | D2.1 106.7,40.03 v106.68,38.1 107.64,39.05 C4.2 | D8.1 45.74,40.03 v45.72,39.37 46.04,39.05 C32.2 | D6.1 66.06,40.03 v66.04,36.83 68.27,39.05 C25.2 | D4.1 86.39,40.03 v86.36,38.1 87.31,39.05 C18.2 | C33.1 59.38,39.05 v60.96,37.47 | C26.1 79.69,39.05 v80.64,38.1 | C19.1 100.02,39.05 v100.97,38.1 | C5.1 117.8,39.05 v117.47,39.37 | U2.4 51.9,6.53 48.58,9.84 C47.2
  Top 0.813: C21.2 27.38,16.27 IC16.1 29.93,18.82
  Top 1.27: C15.2 20.32,15.24 22.86,12.7 25.4,12.7 26.35,13.65 C21.2 | v29.21,17.14 29.21,18.1 C28.2 | C12.2 C9.2 C11.2 C10.2 80.33,24.13 v81.92,24.13 | C1.- 40.64,3.17 v42.55,5.08
  other vias: 47.62,72.39 38.73,57.15 49.53,72.39 47.62,74.3 49.53,74.3 41.27,76.2 40.01,76.2
  pour Bottom (isolate 0.406): 0,101.6 0,0 127,0 127,101.6
  pour Top (isolate 0.406): 34.92,76.2 35.56,76.83 38.1,76.83 38.73,77.15 42.23,77.15 43.81,75.56 55.56,75.56 56.52,74.61 56.52,68.58 54.29,66.36 49.85,66.36 47.62,68.58 47.62,70.48 43.18,74.93 38.73,74.93 38.1,74.3 35.56,74.3 34.92,74.93
  pour Top: 37.47,62.23 36.83,61.59 36.83,55.88 37.47,55.24 40.01,55.24 40.64,55.88 40.64,61.59 40.01,62.23
  pour Bottom (isolate 0.406, no thermals): 68.58,100.33 68.58,69.22 57.78,69.22 57.78,87.63 50.16,87.63 47.62,84.45 39.37,84.45 36.83,86.36 36.83,95.89 24.13,95.89 24.13,85.72 16.51,78.74 15.88,29.21 1.27,29.21 1.27,100.33
GPIO1A
  Top 0.305: D2.3 107.67,43.54 107.31,43.18 106.05,43.18 105.41,42.55 105.41,36.83 99.06,30.48 82.55,30.48 76.2,24.13 76.2,23.5 73.35,20.64 IC3.95 70.17,20.64 65.67,16.14 IC3.40
  Top 0.61: D2.3 107.67,46.71 109.22,48.26 PTC1.1
GPIO1B
  Top 0.305: D2.2 105.16,44.2 104.78,43.81 104.78,36.83 99.06,31.11 82.55,31.11 75.56,24.13 75.56,23.5 73.22,21.14 IC3.96 70.04,21.14 65.54,16.64 IC3.39
  Top 0.61: D2.2 105.74,48.44 PTC2.1
GPIO2A
  Top 0.305: D4.3 87.35,43.54 87,43.18 85.72,43.18 85.09,42.55 85.09,34.29 74.93,24.13 74.93,23.5 73.08,21.64 IC3.97 69.91,21.64 66.04,17.78 59.05,17.78 58.69,18.14 IC3.36
  Top 0.61: D4.3 87.35,46.71 88.9,48.26 PTC3.1
GPIO2B
  Top 0.305: D4.2 85.42,44.15 84.45,43.18 84.45,34.29 74.3,24.13 74.3,23.5 72.94,22.14 IC3.98 69.77,22.14 66.04,18.41 59.05,18.41 58.83,18.64 IC3.35
  Top 0.61: D4.2 85.42,48.44 PTC4.1
GPIO3A
  Top 0.305: D6.3 67.03,43.54 66.67,43.18 65.41,43.18 64.77,42.55 64.77,34.92 70.48,29.21 71.75,29.21 73.66,27.3 73.66,23.5 72.81,22.64 IC3.99 69.64,22.64 66.04,19.05 59.69,19.05 57.59,21.14 IC3.30
  Top 0.61: D6.3 67.03,46.71 68.58,48.26 PTC5.1
GPIO3B
  Top 0.305: D6.2 65.1,44.15 64.14,43.18 64.14,34.92 70.48,28.57 71.75,28.57 73.03,27.3 73.03,23.5 72.67,23.14 IC3.100 69.5,23.14 66.04,19.68 59.69,19.68 57.73,21.64 IC3.29
  Top 0.61: D6.2 65.1,48.44 PTC6.1
GPIO4A
  Top 0.305: D8.3 46.71,43.54 46.35,43.18 45.09,43.18 44.45,42.55 44.45,35.56 48.01,32 65.15,32 69.5,27.66 IC3.1 69.5,23.78 66.04,20.32 59.69,20.32 56.87,23.14 IC3.26
  Top 0.61: D8.3 46.71,46.71 48.26,48.26 PTC7.1
GPIO4B
  Top 0.305: D8.2 44.78,44.15 43.81,43.18 43.81,35.56 48.01,31.37 65.15,31.37 69,27.52 IC3.2 69,23.91 66.04,20.95 59.69,20.95 57.5,23.14 IC3.25
  Top 0.61: D8.2 44.78,48.44 PTC8.1
GPS_RXD  (via drill 0.5, 0.6)
  Top 0.254: IC3.37 53.84,17.64 v53.34,17.14
  Top 0.305: v51.44,2.54 52.07,2.54 52.9,3.37 U2.5
  Bottom 0.254: 53.34,15.24 52.7,15.88 52.7,16.51 v53.34,17.14
  Bottom 0.305: v51.44,2.54 53.34,4.45 53.34,10.79 54.61,12.06 54.61,13.97 53.34,15.24
GPS_TXD  (via drill 0.5, 0.6)
  Top 0.254: 54.61,17.14 53.98,16.51 v53.98,15.88
  Top 0.305: v53.34,2.54 53.9,3.1 U2.6 | IC3.38 54.61,17.14
  Bottom 0.305: v53.34,2.54 53.98,3.17 53.98,10.79 55.24,12.06 55.24,14.61 v53.98,15.88
LED_STATUS  (via drill 0.6)
  Top 0.305: IC3.20 60,23.82 v60.96,22.86 | LED1.C 50.8,25.4 50.16,25.4 v49.21,26.35
  Bottom 0.305: v60.96,22.86 59.69,24.13 57.15,24.13 54.93,21.91 54.93,19.37 54.29,18.73 53.66,18.73 52.07,20.32 52.07,23.5 v49.21,26.35
LED_STATUS1
  Top 0.305: U1.21 114.12,5.7 LED2.C
MOT1_5V
  Top 0.61: X8.2 31.11,5.08 33.66,2.54 JP1.3
MOT1_A
  pour Top (isolate 0.406, no thermals): 100.97,100.33 100.97,92.08 109.54,83.5 109.54,77.79 111.44,75.88 113.67,75.88 113.67,86.36 107.63,92.39 107.63,100.33
MOT1_B
  pour Top (isolate 0.406, no thermals): 108.58,100.33 108.58,92.71 114.62,86.68 114.62,75.88 118.11,75.88 118.11,100.33
MOT1_C
  pour Top (isolate 0.406, no thermals): 93.66,100.33 93.66,69.53 118.11,69.53 118.11,74.93 111.12,74.93 108.58,77.47 108.58,83.19 100.01,91.76 100.01,100.33
MOT1_SIG  (via drill 0.5, 0.6)
  Top 0.305: IC3.46 53.78,13.14 v53.34,12.7 | v43.18,12.06 41.91,10.79 31.75,10.79 X8.1
  Bottom 0.305: v53.34,12.7 43.81,12.7 v43.18,12.06
MOT2_5V
  Top 0.61: X9.2 26.04,5.08 27.3,6.35 32.38,6.35 33.66,7.62 JP1.1
MOT2_A
  pour Top (isolate 0.406, no thermals): 75.56,100.33 75.56,91.44 83.19,83.82 83.19,78.42 85.72,75.88 88.27,75.88 88.27,86.36 82.23,92.39 82.23,100.33
MOT2_B
  pour Top (isolate 0.406, no thermals): 83.19,100.33 83.19,92.71 89.22,86.68 89.22,75.88 92.71,75.88 92.71,100.33
MOT2_C
  pour Top (isolate 0.406, no thermals): 68.26,100.33 68.26,69.53 92.71,69.53 92.71,74.93 85.41,74.93 82.23,78.11 82.23,83.19 74.61,91.12 74.61,100.33
MOT2_SIG  (via drill 0.5, 0.6)
  Top 0.305: IC3.45 53.02,13.64 v52.7,13.97 | v41.91,12.06 28.57,12.06 24.13,7.62 X9.1
  Bottom 0.305: v52.7,13.97 52.07,13.34 43.18,13.34 v41.91,12.06
N$1
  Top 0.305: IC1.4 113.97,34.28 C2.2
N$2
  Top 0.305: C2.1 110.81,33.34 111.76,34.29 112.39,34.29 112.67,34.57 IC1.2
N$3
  Top 0.305: IC1.5 114.62,34.28 C3.1
N$4
  Top 0.305: IC1.6 115.28,34.59 115.57,34.29 116.84,34.29 117.79,33.34 C3.2
N$5  (via drill 0.6)
  Top 0.305: R2.1 97.47,6.03 96.52,5.08 90.17,5.08 ISP1.5 | IC3.90 72.75,18.14 v74.3,19.68
  Bottom 0.305: ISP1.5 90.17,10.16 83.82,16.51 74.93,16.51 73.03,18.41 73.03,19.05 73.66,19.68 v74.3,19.68
N$6
  Top 0.305: LED1.A R3.1
N$7  (via drill 0.6)
  Top 0.305: IC3.89 73.53,17.64 v74.3,18.41
  Bottom 0.305: v74.3,18.41 75.56,17.14 83.82,17.14 90.81,10.16 90.81,8.26 91.44,7.62 93.98,7.62 ISP1.1
N$8
  Top 0.254: T1.3 20.6,57.43 17.78,54.61 17.78,49.85 R5.2
N$9
  Top 0.305: LED2.A R7.1
N$10
  Top 0.305: C4.1 112.71,37.15 113.33,36.53 IC1.3
N$11
  Top 0.305: C5.2 117.16,37.15 115.92,35.91 IC1.7
N$12  (via drill 0.38, 0.6)
  Top 0.305: R8.1 111.69,55.24 106.05,55.24 104.14,53.34 104.14,36.83 99.69,32.38 v99.06,32.38 | IC4.19 97.16,21.59 v96.52,22.23
  Bottom 0.305: v99.06,32.38 98.42,31.75 98.42,26.04 95.89,23.5 95.89,22.86 v96.52,22.23
  pour Top: 112.08,55.88 112.08,60.64 120.97,60.64 121.92,59.69 121.92,58.74 121.28,58.1 117.47,58.1 115.25,55.88
  pour Top (isolate 0.406, no thermals): 113.03,60.64 113.03,55.88 115.25,55.88 116.84,57.47 116.84,60.64
N$13
  Top 0.254: R6.2 19.37,61.33 T1.2 | S1.1 22.94,60.96 T1.2 | T1.2 21.34,59.31 22.86,57.78 22.86,54.93 C13.2
  Top 0.305: Q1.1 17.11,65.76 R6.2 | C13.2 R4.1
N$14  (via drill 0.38, 0.6)
  Top 0.305: R9.1 91.36,55.24 85.72,55.24 83.82,53.34 83.82,34.92 v80.64,31.75 | IC4.17 97.16,19.05 95.25,20.95 93.34,20.95 v92.08,22.23
  Bottom 0.305: v80.64,31.75 81.92,31.75 91.44,22.23 v92.08,22.23
  pour Top: 91.76,55.88 91.76,60.64 100.65,60.64 101.6,59.69 101.6,58.74 100.97,58.1 97.16,58.1 94.93,55.88
  pour Top (isolate 0.406, no thermals): 93.34,60.64 93.34,55.88 94.93,55.88 96.52,57.47 96.52,60.64
N$15  (via drill 0.38, 0.6)
  Top 0.305: R10.1 71.05,55.24 65.41,55.24 63.5,53.34 63.5,34.92 71.12,27.3 v71.75,27.3 | v92.71,19.05 94.61,19.05 97.16,16.51 IC4.15
  Bottom 0.305: v92.71,19.05 92.71,19.68 84.45,27.94 76.2,27.94 74.93,26.67 72.39,26.67 v71.75,27.3
  pour Top: 71.44,55.88 71.44,60.64 80.33,60.64 81.28,59.69 81.28,58.74 80.64,58.1 76.83,58.1 74.61,55.88
  pour Top (isolate 0.406, no thermals): 72.39,60.64 72.39,55.88 74.61,55.88 76.2,57.47 76.2,60.64
N$16  (via drill 0.6)
  Top 0.305: R11.1 50.73,55.24 45.09,55.24 43.18,53.34 43.18,35.56 48.01,30.73 65.15,30.73 66.99,28.89 v66.99,27.62 | IC4.13 96.52,13.97 v94.61,15.88
  Bottom 0.305: v94.61,15.88 93.34,15.88 90.81,18.41 90.81,20.32 84.45,26.67 76.2,26.67 74.93,25.4 70.48,25.4 68.26,27.62 v66.99,27.62
  pour Top: 51.12,55.88 51.12,60.64 60.01,60.64 60.96,59.69 60.96,58.74 60.33,58.1 56.52,58.1 54.29,55.88
  pour Top (isolate 0.406, no thermals): 52.07,60.33 52.07,55.88 54.29,55.88 55.88,57.47 55.88,60.33
N$17
  Top 0.305: R32.1 34.29,42.55 48.01,28.83 63.25,28.83 65,27.07 IC3.10
N$18  (via drill 0.38, 0.6)
  Top 0.305: T7.4 101.28,57.47 102.23,58.42 102.23,60.33 102.87,60.96 103.5,60.96 104.14,60.33 104.14,59.05 105.41,57.78 105.41,55.88 103.5,53.98 103.5,36.83 100.33,33.66 v99.06,33.66 | v95.25,19.68 97.16,17.78 IC4.16
  Bottom 0.305: v99.06,33.66 97.79,32.38 97.79,26.04 95.25,23.5 v95.25,19.68
N$19  (via drill 0.38, 0.6)
  Top 0.305: 80.33,57.47 T8.4 82.86,57.47 83.82,56.52 83.82,54.61 83.19,53.98 83.19,35.56 79.38,31.75 v79.38,30.48 | v94.61,17.78 97.16,15.24 IC4.14
  Bottom 0.305: v94.61,17.78 94.61,18.41 82.55,30.48 v79.38,30.48
N$20  (via drill 0.38, 0.6)
  Top 0.305: T9.4 60.65,57.47 61.59,58.42 61.59,60.33 62.23,60.96 62.87,60.96 63.5,60.33 63.5,59.05 64.77,57.78 64.77,55.88 62.87,53.98 62.87,34.92 70.48,27.3 v70.48,26.67 | v92.71,17.78 92.71,16.51 96.52,12.7 IC4.12
  Bottom 0.305: v70.48,26.67 71.12,26.04 74.93,26.04 76.2,27.3 84.45,27.3 91.44,20.32 91.44,19.05 v92.71,17.78
N$21
  Top 0.305: IC7.4 93.66,34.28 C16.2
N$22
  Top 0.305: IC7.2 92.36,34.57 92.08,34.29 91.44,34.29 90.49,33.34 C16.1
N$23
  Top 0.305: IC7.6 94.95,34.59 95.25,34.29 96.52,34.29 97.47,33.34 C17.2
N$24
  Top 0.305: IC7.5 94.31,34.28 C17.1
N$25
  Top 0.305: IC7.3 93,36.53 92.39,37.15 C18.1
N$26
  Top 0.305: IC7.7 95.61,35.91 96.84,37.15 C19.2
N$27
  Top 0.305: IC11.4 73.33,34.28 C23.2
N$28
  Top 0.305: IC11.2 72.03,34.57 71.75,34.29 71.12,34.29 70.17,33.34 C23.1
N$29
  Top 0.305: IC11.6 74.64,34.59 74.93,34.29 76.2,34.29 77.15,33.34 C24.2
N$30
  Top 0.305: IC11.5 73.98,34.28 C24.1
N$31
  Top 0.305: C25.1 72.07,37.15 72.69,36.53 IC11.3
N$32
  Top 0.305: C26.2 76.52,37.15 75.28,35.91 IC11.7
N$33
  Top 0.254: IC15.4 53.02,34.03 C30.2
N$34
  Top 0.254: IC15.2 51.72,34.7 51.31,34.29 51.05,34.29 50.36,33.59 C30.1
N$35
  Top 0.254: C31.2 56.32,33.85 55.88,34.29 54.61,34.29 54.31,34.59 IC15.6
N$36
  Top 0.254: IC15.5 53.66,34.03 C31.1
N$37
  Top 0.305: C32.1 51.75,37.15 52.37,36.53 IC15.3
N$38
  Top 0.305: C33.2 56.2,37.15 54.97,35.91 IC15.7
N$39
  Top 0.305: C41.1 37.91,77.15 IC2.6
N$40
  Top 0.61: X17.1 17.77,23.82 C15.1 20.32,21.32 L4.1
N$41
  Top 0.406: IC2.11 41.62,71.51 D9.C
  Top 1.27: D9.C 44.77,70.48 C42.2
N$42
  Top 0.406: C42.1 46.67,67.63 46.99,67.94 46.99,70.48 43.53,73.94 42.27,73.94 IC2.12
  Top 1.27: L1.1 43.49,65.41 C42.1
  pour Top: 41.27,67.31 41.91,67.94 43.81,67.94 44.45,67.31 44.45,59.05 43.81,58.42 41.91,58.42 41.27,59.05
N$43
  Top 0.305: U2.1 46.84,4.45 LED3.C
N$44  (via drill 0.6)
  Top 0.305: R22.1 R24.2 39.05,82.86 v39.37,83.19 | IC2.7 37.61,74.15 v37.47,74.3
  Bottom 0.305: v37.47,74.3 37.47,81.28 v39.37,83.19
N$45
  Top 0.305: X17.2 X17.3
N$46
  Top 1.27: X13.3 28.78,90.69 R1.1
N$47
  pour Top (isolate 0.406): 40.64,78.11 40.64,79.38 41.27,80.01 43.18,80.01 43.81,80.64 43.81,82.87 47.62,82.87 50.8,86.04 53.02,86.04 53.02,82.55 56.52,79.06 56.52,77.47 55.56,76.52 44.13,76.52 42.55,78.11
N$48
  Top 0.305: IC8.5 30.45,75.22 R26.2
N$49
  Top 0.305: IC12.5 15.86,75.22 R27.2
N$50
  Top 0.305: LED3.A R28.1
N$51
  Top 1.27: X13.2 26.15,92.19 27.94,93.98 R31.1
PWR_CTL
  Top 0.305: R5.1 21.27,47.3 19.68,45.72 18.41,45.72 17.78,45.09 17.78,41.91 18.41,41.27 28.57,41.27 45.72,24.13 45.72,17.14 58.1,4.76 63.18,4.76 66,7.58 IC3.68
PWR_CTL1
  Top 0.305: IC3.81 80.95,13.64 81.92,14.61 81.92,20.64 R12.1 85.09,23.5 88.27,20.32 IC4.3
PWR_CTL2
  Top 0.305: IC3.79 82.5,12.64 83.19,13.34 83.19,16.83 R13.1 86.67,18.73 87.63,17.78 IC4.5
PWR_CTL3
  Top 0.305: IC3.77 83.08,11.64 R14.1 86.05,13.65 87.63,15.24 IC4.7
PWR_CTL4
  Top 0.305: IC3.75 69.47,9.78 70.48,10.16 84.14,10.16 R15.1 86.68,9.21 87.63,10.16 87.63,12.06 88.27,12.7 IC4.9
PWR_SENSE
  Top 0.254: R6.1 26.04,63.5 27.3,62.23 27.3,44.45 26.04,43.18 D1.3
  Top 0.305: IC3.67 65.5,7.71 63.18,5.4 58.1,5.4 46.35,17.14 46.35,24.13 27.3,43.18 27.3,44.45
RX1_TTL  (via drill 0.5, 0.6)
  Top 0.254: IC3.17 61.5,25.94 v62.23,26.67
  Top 0.305: IC6.4 122.56,46.7 122.56,43.18 120.39,41.02 IC1.9 116.58,40.38 116.2,40.01 v116.2,39.37
  Bottom 0.305: v116.2,39.37 111.76,34.92 81.92,34.92 77.47,30.48 62.87,30.48 62.23,29.84 v62.23,26.67
RX2_TTL  (via drill 0.5, 0.6)
  Top 0.254: IC3.21 59.5,26.48 v59.69,26.67
  Top 0.305: IC10.4 102.23,46.7 102.23,41.91 101.34,41.02 IC7.9 96.25,40.38 95.89,40.01 v95.89,37.47
  Bottom 0.305: v95.89,37.47 94.61,36.2 81.92,36.2 77.47,31.75 62.87,31.75 59.69,28.57 v59.69,26.67
RX3_TTL  (via drill 0.5, 0.6)
  Top 0.305: 81.59,47.31 IC14.4 81.92,46.7 81.92,41.91 81.02,41.02 IC11.9 75.94,37.84 v75.56,37.47 | IC3.31 54.28,20.64 v53.98,20.95
  Bottom 0.305: v53.98,20.95 53.98,21.59 57.15,24.77 57.15,27.3 62.87,33.02 74.3,33.02 75.56,34.29 v75.56,37.47
RX4_TTL  (via drill 0.5, 0.6)
  Top 0.305: IC18.4 61.59,46.7 61.59,41.91 60.7,41.02 IC15.9 55.62,40.38 55.24,40.01 v55.24,37.47 | IC3.27 54.19,22.64 53.98,22.86 53.98,23.18 55.24,24.45 v55.24,26.04
  Bottom 0.305: v55.24,26.04 54.61,26.67 54.61,35.56 55.24,36.2 v55.24,37.47
S1_5V
  Top 0.305: IC5.5 118.42,43.5 114.94,46.99 113.82,46.99 PTC9.2 113.25,46.42 X4.4
S1_12V
  Top 0.61: T6.3 118.23,55.5 X4.1
S1_GPIO_A
  Top 0.61: X4.5 110.64,50.8 PTC1.2
S1_GPIO_B
  Top 0.61: X4.6 113.11,52.63 111.76,53.98 107.31,53.98 106.68,53.34 PTC2.2
S1_RX  (via drill 0.6)
  Top 0.305: X4.2 117.16,50.8 R16.2 | IC1.8 119.64,35.18 120.65,36.2 120.65,40.64 123.19,43.18 v123.19,55.24
  Bottom 0.305: v123.19,55.24 118.75,50.8 X4.2
S1_RX_33V  (via drill 0.6)
  Top 0.305: IC6.1 119.35,51.09 R16.1 121.6,54.3 v120.65,55.24 | D3.3 105.13,60.68 v105.41,60.96
  Bottom 0.305: v120.65,55.24 107.95,55.24 106.05,57.15 106.05,60.33 v105.41,60.96
S1_TX
  Top 0.305: X4.3 115.35,47.21 117.16,45.4 IC5.4 118.72,45.12 120.02,43.81 120.02,43.18 119.38,42.55 114.94,42.55 113.97,41.59 IC1.13
S2_5V
  Top 0.305: X5.4 92.93,46.99 | 92.93,46.99 92.93,46.42 PTC10.2 | IC9.5 98.11,43.5 94.61,46.99 92.93,46.99
S2_12V
  Top 0.61: T7.3 97.91,55.5 X5.1
S2_GPIO_A
  Top 0.61: X5.5 90.32,50.8 PTC3.2
S2_GPIO_B
  Top 0.61: PTC4.2 86.36,53.34 87,53.98 91.58,53.98 X5.6
S2_RX  (via drill 0.6)
  Top 0.305: X5.2 96.84,50.8 R17.2 | IC7.8 101.22,35.18 102.87,36.83 v102.87,55.24
  Bottom 0.305: v102.87,55.24 98.42,50.8 X5.2
S2_RX_33V
  Top 0.305: IC10.1 99.03,51.09 R17.1 101.28,56.2 103.2,58.12 D3.2
S2_TX
  Top 0.305: X5.3 95.03,47.21 96.84,45.4 IC9.4 98.39,45.12 99.69,43.81 99.69,43.18 99.06,42.55 94.61,42.55 93.66,41.59 IC7.13
S3_5V
  Top 0.305: X6.4 72.61,46.42 PTC11.2 73.18,46.99 74.3,46.99 77.78,43.5 IC13.5
S3_12V
  Top 0.61: T8.3 77.59,55.5 X6.1
S3_GPIO_A
  Top 0.61: X6.5 70,50.8 PTC5.2
S3_GPIO_B
  Top 0.61: PTC6.2 66.04,53.34 66.67,53.98 71.26,53.98 X6.6
S3_RX  (via drill 0.6)
  Top 0.305: X6.2 76.52,50.8 R18.2 | IC11.8 79.63,35.18 82.55,38.1 v82.55,55.24
  Bottom 0.305: v82.55,55.24 78.11,50.8 X6.2
S3_RX_33V  (via drill 0.6)
  Top 0.305: IC14.1 78.71,51.09 R18.1 80.96,54.3 v80.01,55.24 | D7.3 64.49,60.68 v64.77,60.96
  Bottom 0.305: v80.01,55.24 67.31,55.24 65.41,57.15 65.41,60.33 v64.77,60.96
S3_TX
  Top 0.305: X6.3 74.71,47.21 76.52,45.4 IC13.4 78.08,45.12 79.38,43.81 79.38,43.18 78.74,42.55 74.3,42.55 73.33,41.59 IC11.13
S4_5V
  Top 0.305: X7.4 52.29,46.42 PTC12.2 52.86,46.99 53.98,46.99 57.47,43.5 IC17.5
S4_12V
  Top 0.61: T9.3 57.27,55.5 X7.1
S4_GPIO_A
  Top 0.61: X7.5 49.68,50.8 PTC7.2
S4_GPIO_B
  Top 0.61: PTC8.2 45.72,53.34 46.35,53.98 50.94,53.98 X7.6
S4_RX  (via drill 0.6)
  Top 0.305: X7.2 56.2,50.8 R19.2 | IC15.8 60.58,35.18 62.23,36.83 v62.23,55.24
  Bottom 0.305: v62.23,55.24 57.78,50.8 X7.2
S4_RX_33V
  Top 0.305: IC18.1 58.39,51.09 R19.1 60.64,56.2 62.56,58.12 D7.2
S4_TX
  Top 0.305: X7.3 54.39,47.21 56.2,45.4 IC17.4 57.76,45.12 59.05,43.81 59.05,43.18 58.42,42.55 53.98,42.55 53.02,41.59 IC15.13
TX1_TTL  (via drill 0.5, 0.6)
  Top 0.254: IC3.18 61,26.63 v60.96,26.67
  Top 0.305: IC5.1 121.31,42.58 120.65,41.91 115.57,41.91 115.28,41.62 IC1.11 115.28,40.34 114.94,40.01 v114.94,39.37
  Bottom 0.305: v114.94,39.37 111.12,35.56 81.92,35.56 77.47,31.11 62.87,31.11 60.96,29.21 v60.96,26.67
TX2_TTL  (via drill 0.5, 0.6)
  Top 0.254: IC3.22 59,26.09 v58.42,26.67
  Top 0.305: IC9.1 101,42.58 100.33,41.91 95.25,41.91 94.95,41.62 IC7.11 94.95,37.8 v94.61,37.47
  Bottom 0.305: v94.61,37.47 93.98,36.83 81.92,36.83 77.47,32.38 62.87,32.38 58.42,27.94 v58.42,26.67
TX3_TTL  (via drill 0.5, 0.6)
  Top 0.305: IC13.1 80.67,42.58 80.01,41.91 74.93,41.91 74.64,41.62 IC11.11 74.64,37.17 v74.3,36.83 | IC3.32 54.44,20.14 v53.98,19.68
  Bottom 0.305: v74.3,36.83 74.93,36.2 74.93,34.29 74.3,33.66 62.87,33.66 56.52,27.3 56.52,24.77 53.02,21.27 53.02,20.64 v53.98,19.68
TX4_TTL  (via drill 0.5, 0.6)
  Top 0.305: IC17.1 60.35,42.58 59.69,41.91 54.61,41.91 54.31,41.62 IC15.11 54.31,40.34 53.98,40.01 v53.98,36.83 | IC3.28 54.05,22.14 53.34,22.86 53.34,25.4 v53.98,26.04
  Bottom 0.305: v53.98,26.04 v53.98,36.83
USER_BUTTON  (via drill 0.6)
  Top 0.305: v66.04,1.91 S2.1 | IC3.55 59.5,7.81 59.69,7.62 v60.33,7.62
  Bottom 0.305: v60.33,7.62 61.59,7.62 66.04,3.17 v66.04,1.91
V+
  Top 0.254: C13.1 R4.2
  Top 0.305: R21.2 9.6,78.22 IC12.1 | C13.1 22.23,56.2 22.23,57.78 21.59,58.42 20.95,58.42 15.24,64.14 8.26,64.14 7.62,64.77
  pour Top (isolate 0.406, no thermals): 1.27,64.77 8.89,64.77 10.79,66.67 10.79,78.11 12.38,79.69 12.38,84.14 11.11,85.41 1.27,85.41
WATER_SENSE
  Top 0.305: X18.1 R32.2

## Text on the board
tNames: BATTERY INPUT | CHARGE | ESC2 | ESC1 | TEMP | WATER | POWERON | ESC POWER | USB PWR | ESC2 | ESC1 | BUTTON | GPS
bNames: CHARGE | ESC2 | ESC1 | PORT 4 | PORT 3 | PORT 2 | PORT 1 | Revision A, (C) 2012 | Main Control Board